# Altium schematic sheet FMC connector.SchDoc: FMC_ADC
size 420 x 297 mm; Author: G.Kasprowicz; CompanyName: WUT ISE; DrawnBy: G.Kasprowicz; Organization: WUT ISE; Address1: PW ISE; Address2: Nowowiejska 15/19 00-665 Warsaw; Address3: gkasprow@gmail.com; Revision: 2; SheetNumber: -; SheetTotal: -; ModifiedBy: -; CheckedDate: -; Title2: FMC HPC connector; DivGrp: WUT ISE; Designer: G.Kasprowicz; ModifiedDate: -; ProjectName: Sensor Box
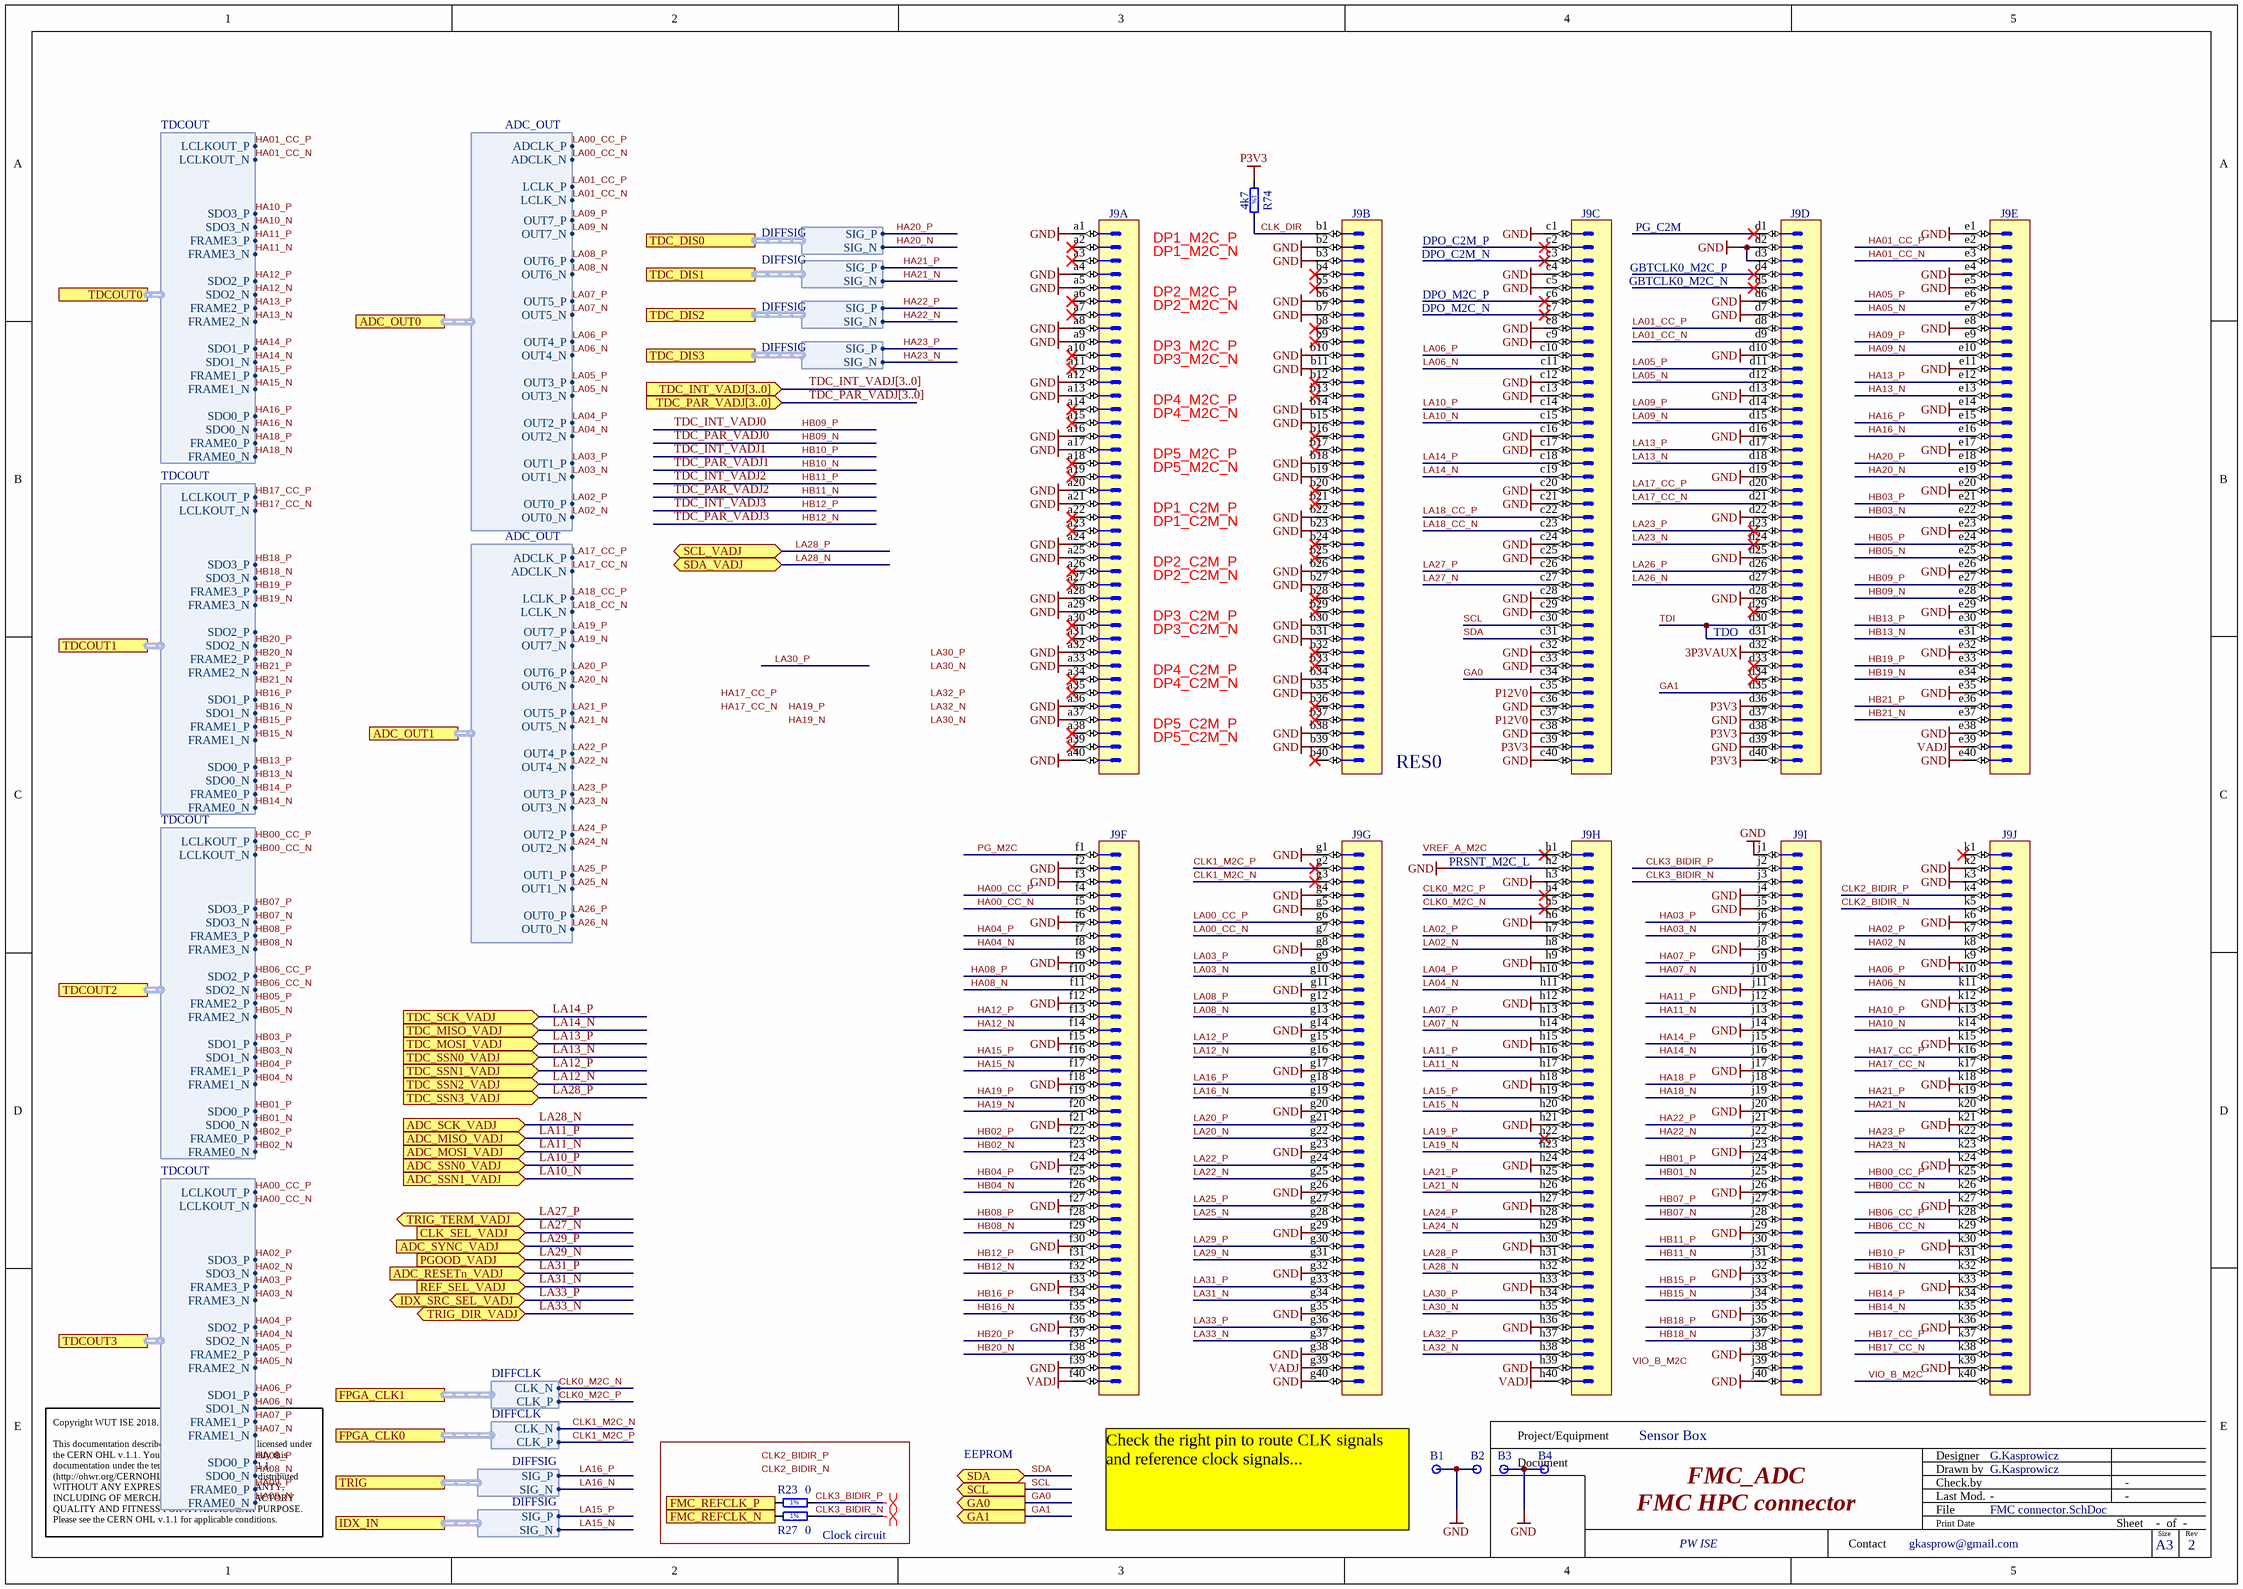
[diagram p0: FMC connector.SchDoc]

## Parts
B1  Plated Hole  [MTG300_600]  (value not drawn)
B2  Plated Hole  [MTG300_600]  (value not drawn)
B3  Plated Hole  [MTG300_600]  (value not drawn)
B4  Plated Hole  [MTG300_600]  (value not drawn)
J9  VITA 57  [SAMTEC_ASP-134488-01]  (value not drawn)  (parts A,B,C,D,E,F,G,H,I,J of 10)
R23  0  [RESC1005X40N]
R27  0  [RESC1005X40N]
R74  4k7  [RESC1608X55N]

## Blocks framed on the sheet
Clock circuit: R23 R27

## Ports
ADC_MISO_VADJ (in), ADC_MOSI_VADJ (in), ADC_OUT0 (harness ADC_OUT), ADC_OUT1 (harness ADC_OUT), ADC_RESETn_VADJ (in), ADC_SCK_VADJ (in), ADC_SSN0_VADJ (in), ADC_SSN1_VADJ (in), ADC_SYNC_VADJ (in), CLK_SEL_VADJ (in), FMC_REFCLK_N (out), FMC_REFCLK_P (out), FPGA_CLK0 (harness DIFFCLK), FPGA_CLK1 (harness DIFFCLK), GA0 (out), GA1 (out), IDX_IN (harness DIFFSIG), IDX_SRC_SEL_VADJ (bidir), PGOOD_VADJ (in), REF_SEL_VADJ (in), SCL (out), SCL_VADJ (bidir), SDA (bidir), SDA_VADJ (bidir), TDC_DIS0 (harness DIFFSIG), TDC_DIS1 (harness DIFFSIG), TDC_DIS2 (harness DIFFSIG), TDC_DIS3 (harness DIFFSIG), TDC_INT_VADJ[3..0] (in), TDC_MISO_VADJ (in), TDC_MOSI_VADJ (in), TDC_PAR_VADJ[3..0] (in), TDC_SCK_VADJ (in), TDC_SSN0_VADJ (in), TDC_SSN1_VADJ (in), TDC_SSN2_VADJ (in), TDC_SSN3_VADJ (in), TDCOUT0 (harness TDCOUT), TDCOUT1 (harness TDCOUT), TDCOUT2 (harness TDCOUT), TDCOUT3 (harness TDCOUT), TRIG (harness DIFFSIG), TRIG_DIR_VADJ (bidir), TRIG_TERM_VADJ (bidir)

## Harnesses
TDCOUT: FRAME0_N, FRAME0_P, SDO0_N, SDO0_P, FRAME1_N, FRAME1_P, SDO1_N, SDO1_P, FRAME2_N, FRAME2_P, SDO2_N, SDO2_P, FRAME3_N, FRAME3_P, SDO3_N, SDO3_P, LCLKOUT_N, LCLKOUT_P
ADC_OUT: LCLK_N, ADCLK_N, OUT7_N, OUT6_N, OUT5_N, OUT4_N, OUT3_N, OUT2_N, OUT1_N, OUT0_N, LCLK_P, ADCLK_P, OUT7_P, OUT6_P, OUT5_P, OUT4_P, OUT3_P, OUT2_P, OUT1_P, OUT0_P
DIFFCLK: CLK_P, CLK_N
DIFFSIG: SIG_N, SIG_P

## Nets
3P3VAUX: J9.d32
GND: B1.1 B2.1 B3.1 B4.1 J9.a1 J9.a4 J9.a5 J9.a8 J9.a9 J9.a12 J9.a13 J9.a16 J9.a17 J9.a20 J9.a21 J9.a24 J9.a25 J9.a28 J9.a29 J9.a32 J9.a33 J9.a36 J9.a37 J9.a40 J9.b2 J9.b3 J9.b6 J9.b7 J9.b10 J9.b11 J9.b14 J9.b15 J9.b18 J9.b19 J9.b22 J9.b23 J9.b26 J9.b27 J9.b30 J9.b31 J9.b34 J9.b35 J9.b38 J9.b39 J9.c1 J9.c4 J9.c5 J9.c8 J9.c9 J9.c12 J9.c13 J9.c16 J9.c17 J9.c20 J9.c21 J9.c24 J9.c25 J9.c28 J9.c29 J9.c32 J9.c33 J9.c36 J9.c38 J9.c40 J9.d2 J9.d3 J9.d6 J9.d7 J9.d10 J9.d13 J9.d16 J9.d19 J9.d22 J9.d25 J9.d28 J9.d37 J9.d39 J9.e1 J9.e4 J9.e5 J9.e8 J9.e11 J9.e14 J9.e17 J9.e20 J9.e23 J9.e26 J9.e29 J9.e32 J9.e35 J9.e38 J9.e40 J9.f2 J9.f3 J9.f6 J9.f9 J9.f12 J9.f15 J9.f18 J9.f21 J9.f24 J9.f27 J9.f30 J9.f33 J9.f36 J9.f39 J9.g1 J9.g4 J9.g5 J9.g8 J9.g11 J9.g14 J9.g17 J9.g20 J9.g23 J9.g26 J9.g29 J9.g32 J9.g35 J9.g38 J9.g40 J9.h2 J9.h3 J9.h6 J9.h9 J9.h12 J9.h15 J9.h18 J9.h21 J9.h24 J9.h27 J9.h30 J9.h33 J9.h36 J9.h39 J9.j1 J9.j4 J9.j5 J9.j8 J9.j11 J9.j14 J9.j17 J9.j20 J9.j23 J9.j26 J9.j29 J9.j32 J9.j35 J9.j38 J9.j40 J9.k2 J9.k3 J9.k6 J9.k9 J9.k12 J9.k15 J9.k18 J9.k21 J9.k24 J9.k27 J9.k30 J9.k33 J9.k36 J9.k39
P3V3: J9.c39 J9.d36 J9.d38 J9.d40 R74.1
P12V0: J9.c35 J9.c37
VADJ: J9.e39 J9.f40 J9.g39 J9.h40
CLK0_M2C_N: J9.h5 ; port FPGA_CLK1.CLK_N
CLK0_M2C_P: J9.h4 ; port FPGA_CLK1.CLK_P
CLK1_M2C_N: J9.g3 ; port FPGA_CLK0.CLK_N
CLK1_M2C_P: J9.g2 ; port FPGA_CLK0.CLK_P
CLK2_BIDIR_N: J9.k5
CLK2_BIDIR_P: J9.k4
CLK3_BIDIR_N: J9.j3 R27.2
CLK3_BIDIR_P: J9.j2 R23.2
CLK_DIR: J9.b1 R74.2
FMC_REFCLK_N: R27.1 ; port FMC_REFCLK_N
FMC_REFCLK_P: R23.1 ; port FMC_REFCLK_P
GA0: J9.c34 ; port GA0
GA1: J9.d35 ; port GA1
HA00_CC_N: J9.f5 ; port TDCOUT3.LCLKOUT_N
HA00_CC_P: J9.f4 ; port TDCOUT3.LCLKOUT_P
HA01_CC_N: J9.e3 ; port TDCOUT0.LCLKOUT_N
HA01_CC_P: J9.e2 ; port TDCOUT0.LCLKOUT_P
HA02_N: J9.k8 ; port TDCOUT3.SDO3_N
HA02_P: J9.k7 ; port TDCOUT3.SDO3_P
HA03_N: J9.j7 ; port TDCOUT3.FRAME3_N
HA03_P: J9.j6 ; port TDCOUT3.FRAME3_P
HA04_N: J9.f8 ; port TDCOUT3.SDO2_N
HA04_P: J9.f7 ; port TDCOUT3.SDO2_P
HA05_N: J9.e7 ; port TDCOUT3.FRAME2_N
HA05_P: J9.e6 ; port TDCOUT3.FRAME2_P
HA06_N: J9.k11 ; port TDCOUT3.SDO1_N
HA06_P: J9.k10 ; port TDCOUT3.SDO1_P
HA07_N: J9.j10 ; port TDCOUT3.FRAME1_N
HA07_P: J9.j9 ; port TDCOUT3.FRAME1_P
HA08_N: J9.f11 ; port TDCOUT3.SDO0_N
HA08_P: J9.f10 ; port TDCOUT3.SDO0_P
HA09_N: J9.e10 ; port TDCOUT3.FRAME0_N
HA09_P: J9.e9 ; port TDCOUT3.FRAME0_P
HA10_N: J9.k14 ; port TDCOUT0.SDO3_N
HA10_P: J9.k13 ; port TDCOUT0.SDO3_P
HA11_N: J9.j13 ; port TDCOUT0.FRAME3_N
HA11_P: J9.j12 ; port TDCOUT0.FRAME3_P
HA12_N: J9.f14 ; port TDCOUT0.SDO2_N
HA12_P: J9.f13 ; port TDCOUT0.SDO2_P
HA13_N: J9.e13 ; port TDCOUT0.FRAME2_N
HA13_P: J9.e12 ; port TDCOUT0.FRAME2_P
HA14_N: J9.j16 ; port TDCOUT0.SDO1_N
HA14_P: J9.j15 ; port TDCOUT0.SDO1_P
HA15_N: J9.f17 ; port TDCOUT0.FRAME1_N
HA15_P: J9.f16 ; port TDCOUT0.FRAME1_P
HA16_N: J9.e16 ; port TDCOUT0.SDO0_N
HA16_P: J9.e15 ; port TDCOUT0.SDO0_P
HA17_CC_N: J9.k17
HA17_CC_P: J9.k16
HA18_N: J9.j19 ; port TDCOUT0.FRAME0_N
HA18_P: J9.j18 ; port TDCOUT0.FRAME0_P
HA19_N: J9.f20
HA19_P: J9.f19
HA20_N: J9.e19 ; port TDC_DIS0.SIG_N
HA20_P: J9.e18 ; port TDC_DIS0.SIG_P
HA21_N: J9.k20 ; port TDC_DIS1.SIG_N
HA21_P: J9.k19 ; port TDC_DIS1.SIG_P
HA22_N: J9.j22 ; port TDC_DIS2.SIG_N
HA22_P: J9.j21 ; port TDC_DIS2.SIG_P
HA23_N: J9.k23 ; port TDC_DIS3.SIG_N
HA23_P: J9.k22 ; port TDC_DIS3.SIG_P
HB00_CC_N: J9.k26 ; port TDCOUT2.LCLKOUT_N
HB00_CC_P: J9.k25 ; port TDCOUT2.LCLKOUT_P
HB01_N: J9.j25 ; port TDCOUT2.SDO0_N
HB01_P: J9.j24 ; port TDCOUT2.SDO0_P
HB02_N: J9.f23 ; port TDCOUT2.FRAME0_N
HB02_P: J9.f22 ; port TDCOUT2.FRAME0_P
HB03_N: J9.e22 ; port TDCOUT2.SDO1_N
HB03_P: J9.e21 ; port TDCOUT2.SDO1_P
HB04_N: J9.f26 ; port TDCOUT2.FRAME1_N
HB04_P: J9.f25 ; port TDCOUT2.FRAME1_P
HB05_N: J9.e25 ; port TDCOUT2.FRAME2_N
HB05_P: J9.e24 ; port TDCOUT2.FRAME2_P
HB06_CC_N: J9.k29 ; port TDCOUT2.SDO2_N
HB06_CC_P: J9.k28 ; port TDCOUT2.SDO2_P
HB07_N: J9.j28 ; port TDCOUT2.SDO3_N
HB07_P: J9.j27 ; port TDCOUT2.SDO3_P
HB08_N: J9.f29 ; port TDCOUT2.FRAME3_N
HB08_P: J9.f28 ; port TDCOUT2.FRAME3_P
HB09_N: J9.e28  [also labelled TDC_PAR_VADJ0]
HB09_P: J9.e27  [also labelled TDC_INT_VADJ0]
HB10_N: J9.k32  [also labelled TDC_PAR_VADJ1]
HB10_P: J9.k31  [also labelled TDC_INT_VADJ1]
HB11_N: J9.j31  [also labelled TDC_PAR_VADJ2]
HB11_P: J9.j30  [also labelled TDC_INT_VADJ2]
HB12_N: J9.f32  [also labelled TDC_PAR_VADJ3]
HB12_P: J9.f31  [also labelled TDC_INT_VADJ3]
HB13_N: J9.e31 ; port TDCOUT1.SDO0_N
HB13_P: J9.e30 ; port TDCOUT1.SDO0_P
HB14_N: J9.k35 ; port TDCOUT1.FRAME0_N
HB14_P: J9.k34 ; port TDCOUT1.FRAME0_P
HB15_N: J9.j34 ; port TDCOUT1.FRAME1_N
HB15_P: J9.j33 ; port TDCOUT1.FRAME1_P
HB16_N: J9.f35 ; port TDCOUT1.SDO1_N
HB16_P: J9.f34 ; port TDCOUT1.SDO1_P
HB17_CC_N: J9.k38 ; port TDCOUT1.LCLKOUT_N
HB17_CC_P: J9.k37 ; port TDCOUT1.LCLKOUT_P
HB18_N: J9.j37 ; port TDCOUT1.SDO3_N
HB18_P: J9.j36 ; port TDCOUT1.SDO3_P
HB19_N: J9.e34 ; port TDCOUT1.FRAME3_N
HB19_P: J9.e33 ; port TDCOUT1.FRAME3_P
HB20_N: J9.f38 ; port TDCOUT1.FRAME2_P
HB20_P: J9.f37 ; port TDCOUT1.SDO2_N
HB21_N: J9.e37
HB21_P: J9.e36 ; port TDCOUT1.FRAME2_N
LA00_CC_N: J9.g7 ; port ADC_OUT0.ADCLK_N
LA00_CC_P: J9.g6 ; port ADC_OUT0.ADCLK_P
LA01_CC_N: J9.d9 ; port ADC_OUT0.LCLK_N
LA01_CC_P: J9.d8 ; port ADC_OUT0.LCLK_P
LA02_N: J9.h8 ; port ADC_OUT0.OUT0_N
LA02_P: J9.h7 ; port ADC_OUT0.OUT0_P
LA03_N: J9.g10 ; port ADC_OUT0.OUT1_N
LA03_P: J9.g9 ; port ADC_OUT0.OUT1_P
LA04_N: J9.h11 ; port ADC_OUT0.OUT2_N
LA04_P: J9.h10 ; port ADC_OUT0.OUT2_P
LA05_N: J9.d12 ; port ADC_OUT0.OUT3_N
LA05_P: J9.d11 ; port ADC_OUT0.OUT3_P
LA06_N: J9.c11 ; port ADC_OUT0.OUT4_N
LA06_P: J9.c10 ; port ADC_OUT0.OUT4_P
LA07_N: J9.h14 ; port ADC_OUT0.OUT5_N
LA07_P: J9.h13 ; port ADC_OUT0.OUT5_P
LA08_N: J9.g13 ; port ADC_OUT0.OUT6_N
LA08_P: J9.g12 ; port ADC_OUT0.OUT6_P
LA09_N: J9.d15 ; port ADC_OUT0.OUT7_N
LA09_P: J9.d14 ; port ADC_OUT0.OUT7_P
LA10_N: J9.c15 ; port ADC_SSN1_VADJ
LA10_P: J9.c14 ; port ADC_SSN0_VADJ
LA11_N: J9.h17 ; port ADC_MOSI_VADJ
LA11_P: J9.h16 ; port ADC_MISO_VADJ
LA12_N: J9.g16 ; port TDC_SSN2_VADJ
LA12_P: J9.g15 ; port TDC_SSN1_VADJ
LA13_N: J9.d18 ; port TDC_SSN0_VADJ
LA13_P: J9.d17 ; port TDC_MOSI_VADJ
LA14_N: J9.c19 ; port TDC_MISO_VADJ
LA14_P: J9.c18 ; port TDC_SCK_VADJ
LA15_N: J9.h20 ; port IDX_IN.SIG_N
LA15_P: J9.h19 ; port IDX_IN.SIG_P
LA16_N: J9.g19 ; port TRIG.SIG_N
LA16_P: J9.g18 ; port TRIG.SIG_P
LA17_CC_N: J9.d21 ; port ADC_OUT1.ADCLK_N
LA17_CC_P: J9.d20 ; port ADC_OUT1.ADCLK_P
LA18_CC_N: J9.c23 ; port ADC_OUT1.LCLK_N
LA18_CC_P: J9.c22 ; port ADC_OUT1.LCLK_P
LA19_N: J9.h23 ; port ADC_OUT1.OUT7_N
LA19_P: J9.h22 ; port ADC_OUT1.OUT7_P
LA20_N: J9.g22 ; port ADC_OUT1.OUT6_N
LA20_P: J9.g21 ; port ADC_OUT1.OUT6_P
LA21_N: J9.h26 ; port ADC_OUT1.OUT5_N
LA21_P: J9.h25 ; port ADC_OUT1.OUT5_P
LA22_N: J9.g25 ; port ADC_OUT1.OUT4_N
LA22_P: J9.g24 ; port ADC_OUT1.OUT4_P
LA23_N: J9.d24 ; port ADC_OUT1.OUT3_N
LA23_P: J9.d23 ; port ADC_OUT1.OUT3_P
LA24_N: J9.h29 ; port ADC_OUT1.OUT2_N
LA24_P: J9.h28 ; port ADC_OUT1.OUT2_P
LA25_N: J9.g28 ; port ADC_OUT1.OUT1_N
LA25_P: J9.g27 ; port ADC_OUT1.OUT1_P
LA26_N: J9.d27 ; port ADC_OUT1.OUT0_N
LA26_P: J9.d26 ; port ADC_OUT1.OUT0_P
LA27_N: J9.c27 ; port CLK_SEL_VADJ
LA27_P: J9.c26 ; port TRIG_TERM_VADJ
LA28_N: J9.h32 ; port ADC_SCK_VADJ, port SDA_VADJ
LA28_P: J9.h31 ; port TDC_SSN3_VADJ, port SCL_VADJ
LA29_N: J9.g31 ; port PGOOD_VADJ
LA29_P: J9.g30 ; port ADC_SYNC_VADJ
LA30_N: J9.h35
LA30_P: J9.h34
LA31_N: J9.g34 ; port REF_SEL_VADJ
LA31_P: J9.g33 ; port ADC_RESETn_VADJ
LA32_N: J9.h38
LA32_P: J9.h37
LA33_N: J9.g37 ; port TRIG_DIR_VADJ
LA33_P: J9.g36 ; port IDX_SRC_SEL_VADJ
PG_M2C: J9.f1
SCL: J9.c30 ; port SCL
SDA: J9.c31 ; port SDA
TDI: J9.d30 J9.d31
VIO_B_M2C: J9.k40
VREF_A_M2C: J9.h1

Not connected (* = marked no-connect by the designer): J9 a2* a3* a6* a7* a10* a11* a14* a15* a18* a19* a22* a23* a26* a27* a30* a31* a34* a35* a38* a39* b4* b5* b8* b9* b12* b13* b16* b17* b20* b21* b24* b25* b28* b29* b32* b33* b36* b37* b40* c2* c3* c6* c7* d1* d4* d5* d29* d33* d34* j39 k1*

## Buses and harness runs
bus TDC_INT_VADJ[3..0] = port TDC_INT_VADJ[3..0]
bus TDC_PAR_VADJ[3..0] = port TDC_PAR_VADJ[3..0]

## Layout directives
differential pair: CLK3_BIDIR_N, CLK3_BIDIR_P

## Notes on the sheet
- DP1_M2C_P
- DP1_M2C_N
- DPO_C2M_P
- DPO_C2M_N
- PG_C2M
- GBTCLK0_M2C_P
- DP2_M2C_P
- DP2_M2C_N
- DPO_M2C_P
- DPO_M2C_N
- GBTCLK0_M2C_N
- DP3_M2C_P
- DP3_M2C_N
- DP4_M2C_P
- DP4_M2C_N
- DP5_M2C_P
- DP5_M2C_N
- DP1_C2M_P
- DP1_C2M_N
- DP2_C2M_P
- DP2_C2M_N
- DP3_C2M_P
- DP3_C2M_N
- (near J9) TDO
- DP4_C2M_P
- DP4_C2M_N
- DP5_C2M_P
- DP5_C2M_N
- RES0
- (near J9) PRSNT_M2C_L
- EEPROM
- (near B1) Check the right pin to route CLK signals and reference clock signals...
- Labels drawn without touching a wire or pin: CLK2_BIDIR_N, CLK2_BIDIR_P, HA17_CC_N, HA17_CC_P, HA19_N, HA19_P, HB21_N, LA30_N, LA30_P, LA32_N, LA32_P, VIO_B_M2C
- Project/Equipment
- Document
- Designer
- Drawn by
- Check.by
- Copyright WUT ISE 2018.
  This documentation describes Open Hardware and is licensed under the CERN OHL v.1.1. You may redistribute and modify this documentation under the terms of the CERN OHL v.1.1. (http://ohwr.org/CERNOHL). This documentation is distributed WITHOUT ANY EXPRESS OR IMPLIED WARRANTY, INCLUDING OF MERCHANTABILITY, SATISFACTORY QUALITY AND FITNESS FOR A PARTICULAR PURPOSE. Please see the CERN OHL v.1.1 for applicable conditions.
- Contact
- File
- Last Mod.
- Print Date
- Sheet
- Size
- A3
- of
- Rev
- (in symbol R0402_0R_JUMPER) 1%
- (in symbol R0603_4K7_1%_0.1W_100PPM) 1%

## Library data of the parts
B1-B4 = PLATED_HOLE3.0_PAD6.0: Single Terminal Socket; Part Description: Plated Through Hole: Hole Dia.=3.0mm Pad Dia.=6.0mm; Mounted: No; Table: Pads; Part Number: PLATED_HOLE3.0_PAD6.0; Component Kind: Standard (No BOM); Component Type: Standard (No BOM); Designator: Single Terminal Socket; Library Reference: Single Terminal Socket; Pin Count: 1; Family: Plated Hole; Socket: No; SMD: No; Status: None; ComponentHeight: 0mm; Author: CERN DEM JLC; CreateDate: 26.05.2008; LatestRevisionDate: 26.05.2008; PackageDescription: Plated Through Hole: Hole Dia.=3.0mm Pad Dia.=6.0mm
J9 = SAMTEC_ASP-134488-01: Connector VITA 57, 400 Male contacts in 10 row abcdefghj; Part Description: 400 contacts (10 rows abcdefghj) Surface Mount Male Connector, VITA 57 (MC-HPC-10); Manufacturer: SAMTEC; Part Number: SAMTEC_ASP-134488-01; Component Kind: Standard; Component Type: Standard; Pin Count: 400; Family: VITA 57; Mounted: Yes; Socket: No; SMD: Yes; Status: None; Manufacturer Part Number: ASP-134488-01; ComponentHeight: 6.1mm; HelpURL: \\cern.ch\dfs\Applications\Altium\Datasheets\SAMTEC_ASP-134488-01.pdf; Author: CERN DEM JLC; CreateDate: 30/04/2009; LatestRevisionDate: 17/08/2009; Table: SAMTEC
R23 R27 = R0402_0R_JUMPER: Resistor - 1%; Part Description: 1A (0.05R Max DC Resistance) Zero Ohm Jumper; Manufacturer: GENERIC; Manufacturer1 Part Number: 232270591001L; Table: Resistors SMD; Part Number: R0402_0R_JUMPER; Component Kind: Standard; Component Type: Standard; Pin Count: 2; Value: 0; Status: Not recommended; Manufacturer Part Number: R0402_0R_JUMPER; Case: 0402; Mounted: Yes; Socket: No; SMD: Yes; Manufacturer1 Example: YAGEO PHYCOMP; Manufacturer1 ComponentHeight: 0.4mm; HelpURL: \\cern.ch\dfs\Applications\Altium\Datasheets\R0402_Phycomp_RC0402.pdf; Author: CERN DEM JLC; CreateDate: 3/12/2007; LatestRevisionDate: 17/10/2012
R74 = R0603_4K7_1%_0.1W_100PPM: Resistor - 1%; Part Description: General Purpose Thick Film Chip Resistor; Manufacturer: GENERIC; Manufacturer1 Part Number: NRC06F4701TRF; Power: 0.1W; TC: ±100ppm/°C; Table: Resistors SMD; Part Number: R0603_4K7_1%_0.1W_100PPM; Component Kind: Standard; Component Type: Standard; Pin Count: 2; Value: 4k7; Status: Preferred; Tolerance: ±1%; Manufacturer Part Number: R0603_4K7_1%_0.1W_100PPM; Case: 0603; Mounted: Yes; Socket: No; SMD: Yes; Manufacturer1 Example: NIC COMPONENT; Manufacturer1 ComponentHeight: 0.55mm; HelpURL: \\cern.ch\dfs\Applications\Altium\Datasheets\R0603_NIC_NRC.pdf; Author: CERN DEM JLC; CreateDate: 03/12/2007; LatestRevisionDate: 13/03/2008